# Altium schematic sheet genPWM.SchDoc
size 381 x 203 mm
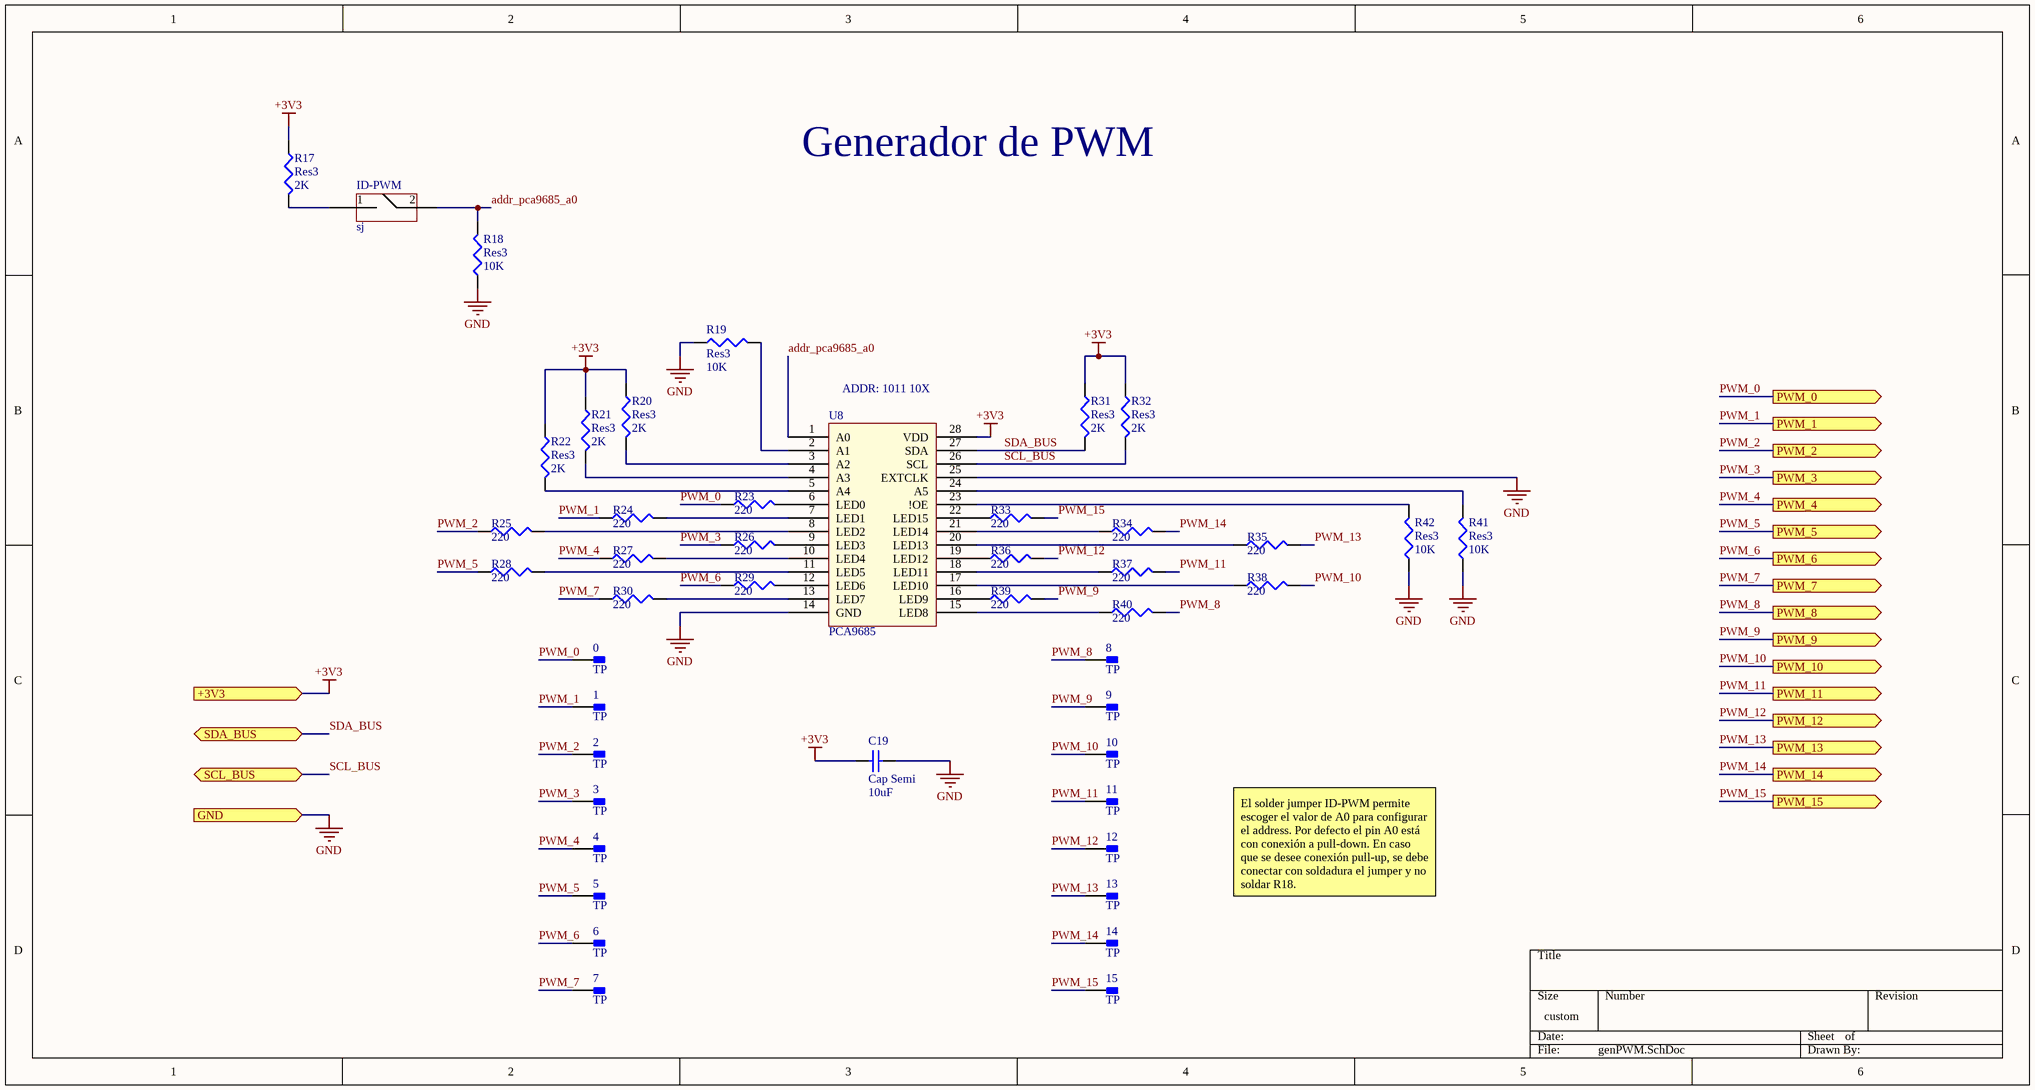
[diagram p0: genPWM.SchDoc]

## Parts
0  TP  [TP]
1  TP  [TP]
2  TP  [TP]
3  TP  [TP]
4  TP  [TP]
5  TP  [TP]
6  TP  [TP]
7  TP  [TP]
8  TP  [TP]
9  TP  [TP]
10  TP  [TP]
11  TP  [TP]
12  TP  [TP]
13  TP  [TP]
14  TP  [TP]
15  TP  [TP]
C19  Cap Semi  value 10uF  [1608[0603]]
ID-PWM  sj  [SJ2]
R17  Res3  value 2K  [J1-0603]
R18  Res3  value 10K  [J1-0603]
R19  Res3  value 10K  [J1-0603]
R20  Res3  value 2K  [J1-0603]
R21  Res3  value 2K  [J1-0603]
R22  Res3  value 2K  [J1-0603]
R23  value 220  [J1-0603]  (hidden comment: Res3)
R24  value 220  [J1-0603]  (hidden comment: Res3)
R25  value 220  [J1-0603]  (hidden comment: Res3)
R26  value 220  [J1-0603]  (hidden comment: Res3)
R27  value 220  [J1-0603]  (hidden comment: Res3)
R28  value 220  [J1-0603]  (hidden comment: Res3)
R29  value 220  [J1-0603]  (hidden comment: Res3)
R30  value 220  [J1-0603]  (hidden comment: Res3)
R31  Res3  value 2K  [J1-0603]
R32  Res3  value 2K  [J1-0603]
R33  value 220  [J1-0603]  (hidden comment: Res3)
R34  value 220  [J1-0603]  (hidden comment: Res3)
R35  value 220  [J1-0603]  (hidden comment: Res3)
R36  value 220  [J1-0603]  (hidden comment: Res3)
R37  value 220  [J1-0603]  (hidden comment: Res3)
R38  value 220  [J1-0603]  (hidden comment: Res3)
R39  value 220  [J1-0603]  (hidden comment: Res3)
R40  value 220  [J1-0603]  (hidden comment: Res3)
R41  Res3  value 10K  [J1-0603]
R42  Res3  value 10K  [J1-0603]
U8  PCA9685  [SSOP-28_L]

## Ports
+3V3 (in), GND (in), PWM_0 (out), PWM_1 (out), PWM_2 (out), PWM_3 (out), PWM_4 (out), PWM_5 (out), PWM_6 (out), PWM_7 (out), PWM_8 (out), PWM_9 (out), PWM_10 (out), PWM_11 (out), PWM_12 (out), PWM_13 (out), PWM_14 (out), PWM_15 (out), SCL_BUS (bidir), SDA_BUS (bidir)

## Nets
+3V3: C19.2 R17.1 R20.1 R21.1 R22.1 R31.1 R32.1 U8.28(VDD) ; port +3V3
GND: C19.1 R18.1 R19.1 R41.1 R42.1 U8.14(GND) U8.25(EXTCLK) ; port GND
addr_pca9685_a0: ID-PWM.2 R18.2 U8.1(A0)
PWM_0: 0.1 R23.1 ; port PWM_0
PWM_1: 1.1 R24.1 ; port PWM_1
PWM_2: 2.1 R25.1 ; port PWM_2
PWM_3: 3.1 R26.1 ; port PWM_3
PWM_4: 4.1 R27.1 ; port PWM_4
PWM_5: 5.1 R28.1 ; port PWM_5
PWM_6: 6.1 R29.1 ; port PWM_6
PWM_7: 7.1 R30.1 ; port PWM_7
PWM_8: 8.1 R40.2 ; port PWM_8
PWM_9: 9.1 R39.2 ; port PWM_9
PWM_10: 10.1 R38.2 ; port PWM_10
PWM_11: 11.1 R37.2 ; port PWM_11
PWM_12: 12.1 R36.2 ; port PWM_12
PWM_13: 13.1 R35.2 ; port PWM_13
PWM_14: 14.1 R34.2 ; port PWM_14
PWM_15: 15.1 R33.2 ; port PWM_15
SCL_BUS: R32.2 U8.26(SCL) ; port SCL_BUS
SDA_BUS: R31.2 U8.27(SDA) ; port SDA_BUS
NetID-PWM_1: ID-PWM.1 R17.2
NetR19_2: R19.2 U8.2(A1)
NetR20_2: R20.2 U8.3(A2)
NetR21_2: R21.2 U8.4(A3)
NetR22_2: R22.2 U8.5(A4)
NetR23_2: R23.2 U8.6(LED0)
NetR24_2: R24.2 U8.7(LED1)
NetR25_2: R25.2 U8.8(LED2)
NetR26_2: R26.2 U8.9(LED3)
NetR27_2: R27.2 U8.10(LED4)
NetR28_2: R28.2 U8.11(LED5)
NetR29_2: R29.2 U8.12(LED6)
NetR30_2: R30.2 U8.13(LED7)
NetR33_1: R33.1 U8.22(LED15)
NetR34_1: R34.1 U8.21(LED14)
NetR35_1: R35.1 U8.20(LED13)
NetR36_1: R36.1 U8.19(LED12)
NetR37_1: R37.1 U8.18(LED11)
NetR38_1: R38.1 U8.17(LED10)
NetR39_1: R39.1 U8.16(LED9)
NetR40_1: R40.1 U8.15(LED8)
NetR41_2: R41.2 U8.24(A5)
NetR42_2: R42.2 U8.23(!OE)

## Notes on the sheet
- Generador de PWM
- (near U8) ADDR: 1011 10X
- El solder jumper ID-PWM permite escoger el valor de A0 para configurar el address. Por defecto el pin A0 está con conexión a pull-down. En caso que se desee conexión pull-up, se debe conectar con soldadura el jumper y no soldar R18.

## Library data of the parts
0-15 = TP: Solder test point
C19 = Cap Semi: Capacitor (Semiconductor SIM Model); Manufacturer: Samsung Electro-Mechanics; Manufacturer Part Number: CL10A106MQ8NNNC; Published: 8-Jun-2000; LatestRevisionDate: 29-May-2009; LatestRevisionNote: IPC-7351 Footprint Added.; PackageReference: C1206; Publisher: Altium Limited; PackageDescription: Chip Capacitor; Supplier 1: LCSC; Supplier Part Number 1: C1691
ID-PWM = Jumper: solder jumper generic
R17 R20-R22 R31 R32 = Res3: Resistor; Manufacturer: YAGEO; Manufacturer Part Number: RC0603FR-072KL; Published: 8-Jun-2000; LatestRevisionDate: 29-May-2009; LatestRevisionNote: IPC-7351 Footprint Added.; PackageReference: J1-0603; Publisher: Altium Limited; PackageDescription: Chip Resistor; Supplier 1: LCSC; Supplier Part Number 1: C105576
R18 R19 R41 R42 = Res3: Resistor; Manufacturer: PANASONIC; Manufacturer Part Number: ERJPA3F1002V; Published: 8-Jun-2000; LatestRevisionDate: 29-May-2009; LatestRevisionNote: IPC-7351 Footprint Added.; PackageReference: J1-0603; Publisher: Altium Limited; PackageDescription: Chip Resistor; Supplier 1: LCSC; Supplier Part Number 1: C441927
R23-R30 R33-R40 = Res3: Resistor; Manufacturer Part Number: RC0603FR-07220RL; Manufacturer: YAGEO; Published: 8-Jun-2000; LatestRevisionDate: 29-May-2009; LatestRevisionNote: IPC-7351 Footprint Added.; PackageReference: J1-0603; Publisher: Altium Limited; PackageDescription: Chip Resistor; Supplier 1: LCSC; Supplier Part Number 1: C107696
U8 = PCA9685: LED Drivers,16CH, I2C, TSSOP-28; Manufacturer: NXP Semicon; Manufacturer Part Number: PCA9685PW/Q900,118; Package: TSSOP-28; Supplier 1: LCSC; Supplier Part Number 1: C92206